# Altium project DCDC Boost Converter.PrjPcb
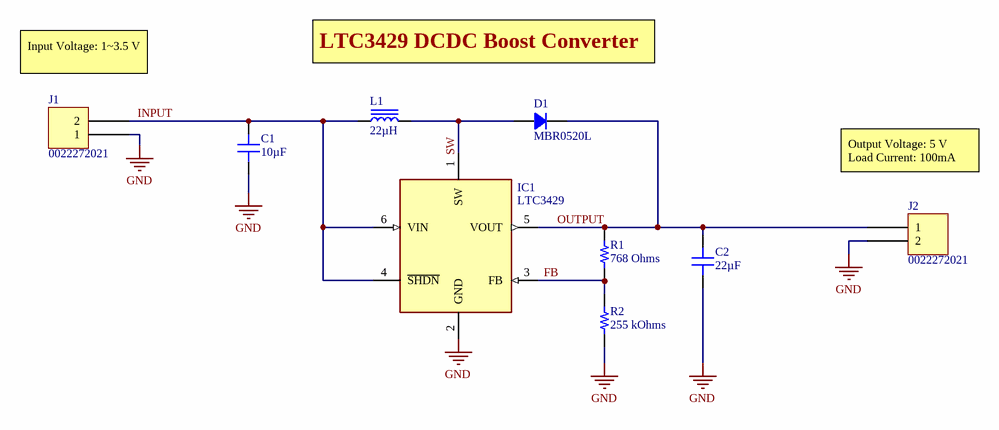
[diagram p0: Boost Converter.SchDoc]
1 sheet, 9 parts. Net scope: global (net labels, ports and power ports of the same name join across sheets).
Board file: Boost Converter.PcbDoc

## Sheet Boost Converter.SchDoc
size A4

### Parts
C1  10µF  [CAP 0805_2012]
C2  22µF  [CAP 1206_3216 - 1.8MM]
D1  MBR0520L  [SOD-123]
IC1  LTC3429  [SOT95P280X100-6N]
J1  0022272021  [MOLEX KK 0022272021]
J2  0022272021  [MOLEX KK 0022272021]
L1  22µH  [TDK SLF7032]
R1  768 Ohms  [RES 0805_2012]
R2  255 kOhms  [RES 0805_2012]

### Nets
GND: C1.1 C2.1 IC1.2(GND) J1.1 J2.2 R2.1
FB: IC1.3(FB) R1.1 R2.2
INPUT: C1.2 IC1.4(~{SHDN}) IC1.6(VIN) J1.2 L1.1
OUTPUT: C2.2 D1.2 IC1.5(VOUT) J2.1 R1.2
NetD1_1: D1.1 IC1.1(SW) L1.2

### Notes on the sheet
- (near J1) Input Voltage: 1~3.5 V
- LTC3429 DCDC Boost Converter
- Output Voltage: 5 V                                  Load Current: 100mA
- Labels drawn without touching a wire or pin: SW

### Library data of the parts
C1 = C2012X6S1C106K125AC: CAP CER 10UF 16V X6S 0805; Manufacturer: TDK Corporation; Tolerance: ±10%; Part Number: C2012X6S1C106K125AC; Value: 10µF; Applications: General Purpose; Capacitance: 10µF; ComponentLink1Description: Datasheet; ComponentLink1URL: https://product.tdk.com/info/en/catalog/datasheets/mlcc_commercial_general_en.pdf?ref_disty=digikey; ComponentLink2Description: DigiKey Link; ComponentLink2URL: http://digikey.com/product-detail/en/tdk-corporation/C2012X6S1C106K125AC/445-7611-1-ND/2733683; Device Package: 0805 (2012 Metric); Features: Low ESL; LastUpdated: 1/21/2020 12:03:05 AM; Lifecycle Status: Active; Minimum Order: 1; Mounting Type: Surface Mount, MLCC; Operating Temperature: -55°C ~ 105°C; Package / Case: 0805 (2012 Metric); Packaging: TapeAndReel; PartId: 2995; Part Status: Active; Price: 0.09; Series: C; Size / Dimension: 0.079" L x 0.049" W (2.00mm x 1.25mm); Supplier 1: DigiKey; Supplier Part Number 1: 445-7611-1-ND; Temperature Coefficient: X6S; Thickness (Max): 0.057" (1.45mm); Voltage - Rated: 16V
C2 = CL31X226KOHN3NE: CAP CER 22UF 16V X6S 1206; Manufacturer: Samsung Electro-Mechanics; Tolerance: ±10%; Part Number: CL31X226KOHN3NE; Value: 22µF; Applications: General Purpose; Capacitance: 22µF; ComponentLink1Description: Datasheet; ComponentLink1URL: http://www.samsungsem.com/kr/support/product-search/mlcc/CL31X226KOHN3NE.jsp; ComponentLink2Description: DigiKey Link; ComponentLink2URL: http://digikey.com/product-detail/en/samsung-electro-mechanics/CL31X226KOHN3NE/1276-3300-1-ND/3891386; Device Package: 1206 (3216 Metric); LastUpdated: 1/21/2020 12:03:49 AM; Lifecycle Status: Active; Minimum Order: 1; Mounting Type: Surface Mount, MLCC; Operating Temperature: -55°C ~ 105°C; Package / Case: 1206 (3216 Metric); Packaging: TapeAndReel; PartId: 19636; Part Status: Active; Price: 0.13; Series: CL; Size / Dimension: 0.126" L x 0.063" W (3.20mm x 1.60mm); Supplier 1: DigiKey; Supplier Part Number 1: 1276-3300-1-ND; Temperature Coefficient: X6S; Thickness (Max): 0.071" (1.80mm); Voltage - Rated: 16V
D1 = MBR0520L: DIODE SCHOTTKY 20V 500MA SOD123; Manufacturer: ON Semiconductor; Current - Reverse Leakage @ Vr: 250µA @ 20V; Speed: Fast Recovery =< 500ns, > 200mA (Io); Voltage - Forward (Vf) (Max) @ If: 385mV @ 500mA; Part Number: MBR0520L; ComponentLink1Description: Datasheet; ComponentLink1URL: https://www.onsemi.cn/PowerSolutions/document/MBR0520L-D.pdf; ComponentLink2Description: DigiKey Link; ComponentLink2URL: http://digikey.com/product-detail/en/on-semiconductor/MBR0520L/MBR0520LCT-ND/458961; Current - Average Rectified (Io): 500mA; Device Package: SOD-123; Diode Type: Schottky; LastUpdated: 1/21/2020 2:42:45 AM; Lifecycle Status: Active; Minimum Order: 1; Mounting Type: Surface Mount; Operating Temperature - Junction: -65°C ~ 125°C; Package / Case: SOD-123; Packaging: TapeAndReel; PartId: 2226; Part Status: Active; Price: 0.06; Series: -; Supplier 1: DigiKey; Supplier Part Number 1: MBR0520LCT-ND; Supplier Device Package: SOD-123; Voltage - DC Reverse (Vr) (Max): 20V
IC1 = LTC3429ES6: Boost Switching Regulator IC Positive Adjustable 2.5V 1 Output 600mA (Switch) SOT-23-6 Thin, TSOT-23-6
J1 J2 = 0022272021: CONN HEADER VERT 2POS 2.54MM; Manufacturer: Molex; Contact Length - Mating: 0.295" (7.49mm); Contact Length - Post: 0.140" (3.56mm); Material Flammability Rating: UL94 V-0; Number of Positions: 2; Number of Positions Loaded: All; Overall Contact Length: 0.560" (14.22mm); Pitch - Mating: 0.100" (2.54mm); Shrouding: Shrouded - 1 Wall; Style: Board to Cable/Wire; Part Number: 0022272021; ComponentLink1Description: Datasheet; ComponentLink1URL: https://www.molex.com/pdm_docs/sd/022272021_sd.pdf; ComponentLink2Description: DigiKey Link; ComponentLink2URL: http://digikey.com/product-detail/en/molex/0022272021/WM4111-ND/1130577; Connector Type: Header; Contact Finish - Mating: Tin; Contact Finish - Post: Tin; Contact Finish Thickness - Mating: 100.0µin (2.54µm); Contact Material: Brass; Contact Shape: Square; Contact Type: Male Pin; Fastening Type: Friction Lock; Insulation Color: Natural; Insulation Height: 0.461" (11.70mm); Insulation Material: Polyamide (PA), Nylon; LastUpdated: 1/12/2020 11:51:43 PM; Lifecycle Status: Active; Minimum Order: 1; Mounting Type: Through Hole; Number of Rows: 1; Packaging: Bulk; PartId: 76; Part Status: Active; Price: 0.27; Series: KK 6410; Supplier 1: DigiKey; Supplier Part Number 1: WM4111-ND; Termination: Solder
L1 = SLF7032T-220MR96-2PF: FIXED IND 22UH 960MA 132 MOHM; Manufacturer: TDK Corporation; DC Resistance (DCR): 132mOhm Max; Inductance Frequency - Test: 100kHz; Material - Core: Ferrite; Shielding: Shielded; Tolerance: ±20%; Type: Wirewound; Part Number: SLF7032T-220MR96-2PF; ComponentLink1Description: Datasheet; ComponentLink1URL: //media.digikey.com/pdf/Data%20Sheets/TDK%20PDFs/SLF7032_Type.pdf; ComponentLink2Description: DigiKey Link; ComponentLink2URL: http://digikey.com/product-detail/en/tdk-corporation/SLF7032T-220MR96-2PF/445-2003-1-ND/755410; Current Rating (Amps): 960mA; Device Package: Nonstandard; Height - Seated (Max): 0.134" (3.40mm); Inductance: 22µH; LastUpdated: 3/30/2020 8:54:50 PM; Lifecycle Status: Active; Minimum Order: 1; Mounting Type: Surface Mount; Operating Temperature: -40°C ~ 105°C; Package / Case: Nonstandard; Packaging: TapeAndReel; PartId: 3680; Part Status: Active; Price: 0.43; Series: SLF; Size / Dimension: 0.276" L x 0.276" W (7.00mm x 7.00mm); Supplier 1: DigiKey; Supplier Part Number 1: 445-2003-1-ND; Value: 22µH
R1 = RMCF0805FT768R: RES 768 OHM 1% 1/8W 0805; Manufacturer: Stackpole Electronics Inc; Power (Watts): 0.125W, 1/8W; Temperature Coefficient: ±100ppm/°C; Part Number: RMCF0805FT768R; Value: 768 Ohms; ComponentLink1Description: Datasheet; ComponentLink1URL: https://www.seielect.com/catalog/sei-rmcf_rmcp.pdf; ComponentLink2Description: DigiKey Link; ComponentLink2URL: http://digikey.com/product-detail/en/stackpole-electronics-inc/RMCF0805FT768R/RMCF0805FT768RCT-ND/1942367; Composition: Thick Film; Device Package: 0805 (2012 Metric); Features: Automotive AEC-Q200; Height - Seated (Max): 0.026" (0.65mm); LastUpdated: 1/21/2020 1:41:18 AM; Lifecycle Status: Active; Minimum Order: 1; Number of Terminations: 2; Operating Temperature: -55°C ~ 155°C; Package / Case: 0805 (2012 Metric); Packaging: CutTape; PartId: 46882; Part Status: Active; Price: 0.10; Ratings: AEC-Q200; Resistance: 768 Ohms; Series: RMCF; Size / Dimension: 0.079" L x 0.049" W (2.00mm x 1.25mm); Supplier 1: DigiKey; Supplier Part Number 1: RMCF0805FT768RCT-ND; Supplier Device Package: 0805; Tolerance: ±1%
R2 = 3-2176094-2: RES SMD 255K OHM 0.1% 1/4W 0805; Manufacturer: TE Connectivity Passive Product; Power (Watts): 0.25W, 1/4W; Temperature Coefficient: ±25ppm/°C; Part Number: 3-2176094-2; Value: 255 kOhms; ComponentLink1Description: Datasheet; ComponentLink1URL: https://www.te.com/commerce/DocumentDelivery/DDEController?Action=srchrtrv&DocNm=1773272&DocType=DS&DocLang=English; ComponentLink2Description: DigiKey Link; ComponentLink2URL: http://digikey.com/product-detail/en/te-connectivity-passive-product/3-2176094-2/A110774CT-ND/4035129; Composition: Thin Film; Device Package: 0805 (2012 Metric); Height - Seated (Max): 0.026" (0.65mm); LastUpdated: 1/21/2020 1:38:54 AM; Lifecycle Status: Active; Minimum Order: 1; Number of Terminations: 2; Operating Temperature: -55°C ~ 155°C; Package / Case: 0805 (2012 Metric); Packaging: TapeAndReel; PartId: 49793; Part Status: Active; Price: 0.15; Resistance: 255 kOhms; Series: RP73P, Holsworthy; Size / Dimension: 0.079" L x 0.049" W (2.00mm x 1.25mm); Supplier 1: DigiKey; Supplier Part Number 1: A110774CT-ND; Supplier Device Package: 0805; Tolerance: ±0.1%